# EAGLE design Pendulum Lamp PCB (EAGLE 9.1.0)
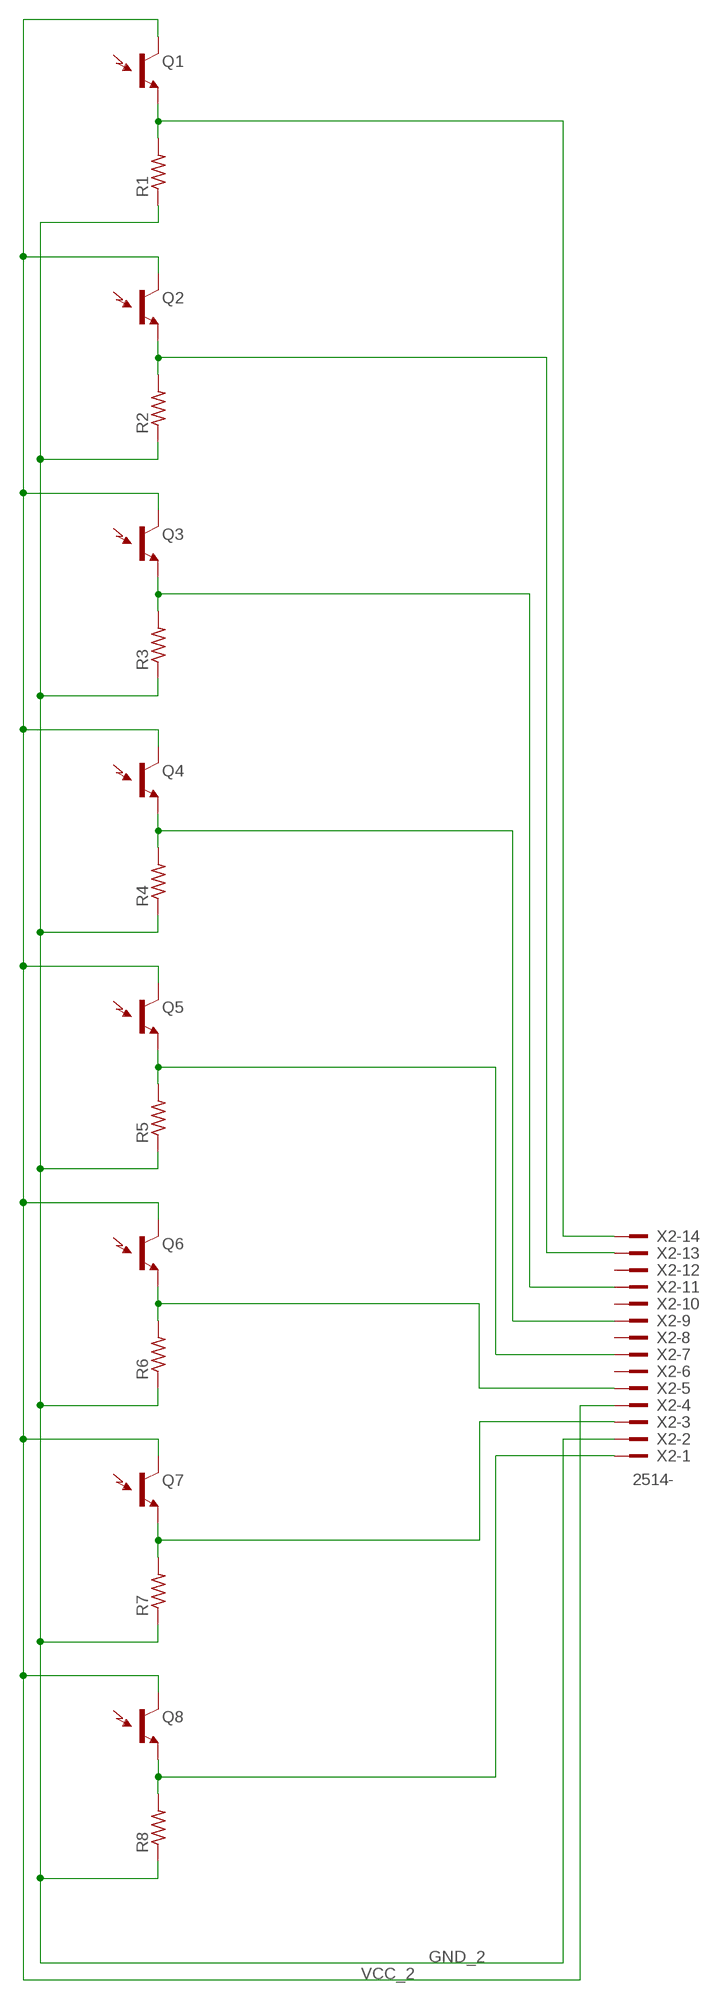
[diagram p0: schematic, sheet 1]

## Parts
Q1  LTR-301  [LTR-301]
Q2  LTR-301  [LTR-301]
Q3  LTR-301  [LTR-301]
Q4  LTR-301  [LTR-301]
Q5  LTR-301  [LTR-301]
Q6  LTR-301  [LTR-301]
Q7  LTR-301  [LTR-301]
Q8  LTR-301  [LTR-301]
R1  R-US_0204/7  [0204/7]
R2  R-US_0204/7  [0204/7]
R3  R-US_0204/7  [0204/7]
R4  R-US_0204/7  [0204/7]
R5  R-US_0204/7  [0204/7]
R6  R-US_0204/7  [0204/7]
R7  R-US_0204/7  [0204/7]
R8  R-US_0204/7  [0204/7]
X2  2514-  [PAK100/2500-14]

## Nets
GND_2: R1.1 R2.1 R3.1 R4.1 R5.1 R6.1 R7.1 R8.1 X2.2
N$31: Q1.E(E1) R1.2 X2.14
N$36: Q2.E(E1) R2.2 X2.13
N$40: Q3.E(E1) R3.2 X2.11
N$44: Q4.E(E1) R4.2 X2.9
N$48: Q5.E(E1) R5.2 X2.7
N$52: Q6.E(E1) R6.2 X2.5
N$56: Q7.E(E1) R7.2 X2.3
N$60: Q8.E(E1) R8.2 X2.1
VCC_2: Q1.C(C1) Q2.C(C1) Q3.C(C1) Q4.C(C1) Q5.C(C1) Q6.C(C1) Q7.C(C1) Q8.C(C1) X2.4
Unconnected: X2.6 X2.8 X2.10 X2.12

## Library data of the parts
Q1-Q8 = SparkFun-Sensors:LTR-301: LiteOn LTR-301 IR Phototransistor (Side-Receiving) Side-looking Infrared detectors. These simple devices operate at 940nm and work well for generic IR systems including remote control and touch-less object sensing. Using a simple ADC on any microcontroller will allow variable readings to be collected from the detector. Datasheet <http://www.sparkfun.com/datasheets/Components/LTR-301.pdf> SparkFun Products Infrared Emitters and Detectors <https://www.sparkfun.com/products/241> (SEN-00241); PROD_ID: DIO-10904; SF_ID: SEN-00241
R1-R8 = rcl:R-US_: RESISTOR, American symbol; SPICEPREFIX: R
X2 = con-3m:2514-: 3M (TM) Pak 100 4-Wall Header Source: 3M; OC_FARNELL: unknown; OC_NEWARK: unknown

## Board
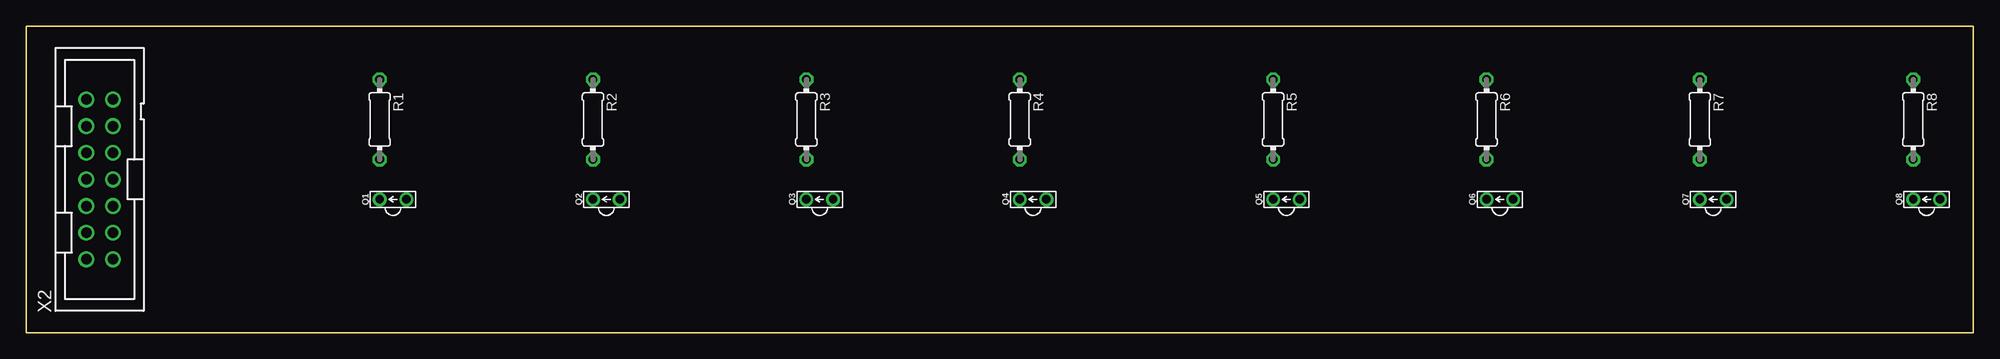
[diagram p1: board, top side]
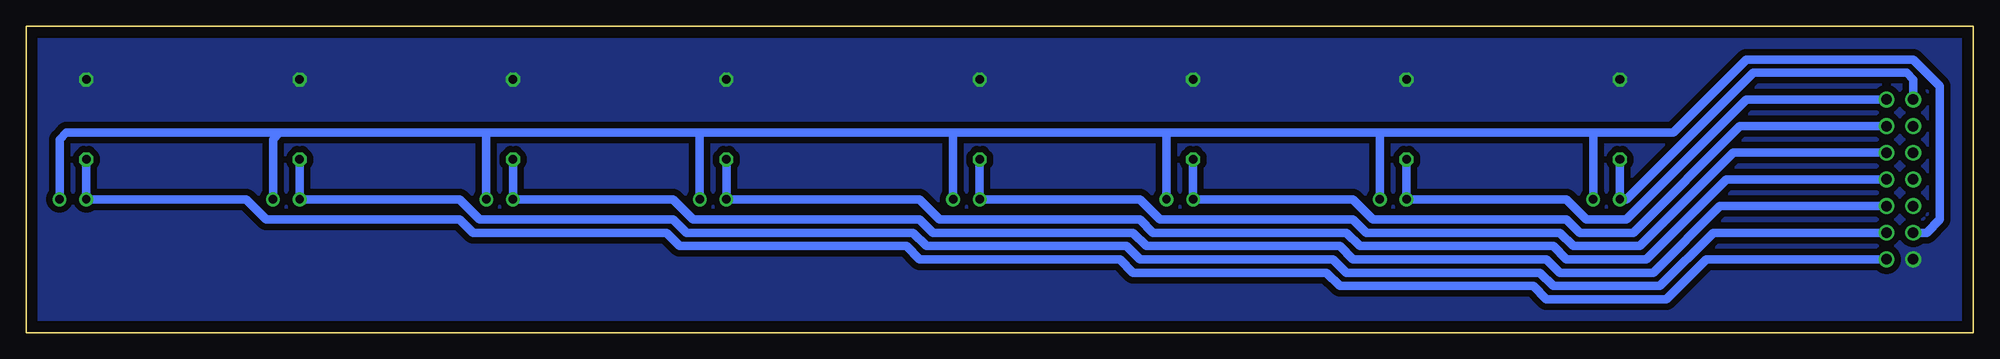
[diagram p2: board, bottom side, seen from below]

Size 185.42 x 29.21 mm. Coordinates in mm from the lower left corner, seen from the top.
Outline: 0,0 185.42,0 185.42,29.21 0,29.21 0,0
Copper layers (1*16): Top 0.035mm / dielectric 1.5mm / Bottom 0.035mm
Design rules "default *": minimum track width 6mil, minimum drill 0.35mm, track to track 15mil, track to pad 15mil, pad to pad 15mil, via to via 15mil, smd to smd 15mil, copper to edge 40mil, drill to drill 6mil, minimum pad ring 10mil, minimum via ring 8mil, stop-mask expansion 4mil, vias tented up to drill 0mil, thermal gap 10mil

### Footprints (pad centres in the part's own frame; a part is rotated, then mirrored left to right if it is on the bottom)
LTR-301 = drill 0.8: C 1.27,0; E -1.27,0
0204/7 = drill 0.813 octagon: 1 -3.81,0; 2 3.81,0
PAK100/2500-14 = drill 1 pad 1.422: 1 -7.62,-1.27; 2 -7.62,1.27; 3 -5.08,-1.27; 4 -5.08,1.27; 5 -2.54,-1.27; 6 -2.54,1.27; 7 0,-1.27; 8 0,1.27; 9 2.54,-1.27; 10 2.54,1.27; 11 5.08,-1.27; 12 5.08,1.27; 13 7.62,-1.27; 14 7.62,1.27

### Placement (x,y rotation side)
Q1  34.92,12.7 0 top
Q2  55.24,12.7 0 top
Q3  75.56,12.7 0 top
Q4  95.88,12.7 0 top
Q5  120.02,12.7 0 top
Q6  140.34,12.7 0 top
Q7  160.66,12.7 0 top
Q8  180.97,12.7 0 top
R1  33.66,20.32 270 top
R2  53.97,20.32 270 top
R3  74.3,20.32 270 top
R4  94.61,20.32 270 top
R5  118.75,20.32 270 top
R6  139.06,20.32 270 top
R7  159.38,20.32 270 top
R8  179.7,20.32 270 top
X2  6.98,14.6 90 top

### Tracks (layer width: path | path; a pad name or v marks a point on that pad's centre or on a via)
GND_2
  pour Bottom (isolate 0.61, no thermals): -0.63,29.84 -0.63,-0.63 185.42,-0.63 186.06,0 186.06,29.84
N$31
  Bottom 0.813: R1.2 Q1.E 33.02,12.7 20.95,24.77 6.35,24.77 5.71,24.13 X2.14
N$36
  Bottom 0.813: X2.13 21.59,22.23 33.02,10.79 36.83,10.79 38.73,12.7 Q2.E R2.2
N$40
  Bottom 0.813: R3.2 Q3.E 59.05,12.7 57.15,10.79 38.73,10.79 37.46,9.53 32.38,9.53 22.23,19.69 X2.11
N$44
  Bottom 0.813: R4.2 Q4.E 79.38,12.7 77.47,10.79 59.05,10.79 57.78,9.53 39.37,9.53 38.1,8.26 31.75,8.26 22.86,17.15 X2.9
N$48
  Bottom 0.813: R5.2 Q5.E 100.33,12.7 98.42,10.79 79.38,10.79 78.11,9.53 59.69,9.53 58.42,8.26 40.01,8.26 38.73,6.98 31.12,6.98 23.49,14.6 X2.7
N$52
  Bottom 0.813: R6.2 Q6.E 123.83,12.7 121.92,10.79 100.33,10.79 99.06,9.53 80.01,9.53 78.74,8.26 60.32,8.26 59.05,6.98 40.64,6.98 39.37,5.71 30.48,5.71 24.13,12.06 X2.5
N$56
  Bottom 0.813: R7.2 Q7.E 144.15,12.7 142.24,10.79 123.83,10.79 122.55,9.53 100.97,9.53 99.69,8.26 80.64,8.26 79.38,6.98 60.96,6.98 59.69,5.71 41.27,5.71 40.01,4.45 29.84,4.45 24.77,9.53 X2.3
N$60
  Bottom 0.813: R8.2 Q8.E 164.47,12.7 162.56,10.79 144.15,10.79 142.88,9.53 124.46,9.53 123.19,8.26 101.6,8.26 100.33,6.98 81.28,6.98 80.01,5.71 61.59,5.71 60.32,4.45 41.91,4.45 40.64,3.18 29.21,3.18 25.4,6.98 X2.1
VCC_2
  Bottom 0.813: Q1.C 36.2,19.05 | 36.2,19.05 36.83,19.05 56.52,19.05 | 56.52,19.05 76.83,19.05 | 76.83,19.05 97.16,19.05 | 97.16,19.05 121.28,19.05 | 121.28,19.05 141.6,19.05 | 141.6,19.05 161.29,19.05 | 161.29,19.05 181.61,19.05 182.25,18.41 Q8.C | Q7.C 161.93,18.41 161.29,19.05 | Q6.C 141.6,19.05 | Q5.C 121.28,19.05 | Q4.C 97.16,19.05 | Q3.C 76.83,19.05 | Q2.C 56.52,19.05 | 36.2,19.05 28.58,19.05 21.59,26.03 5.71,26.03 3.17,23.49 3.17,10.79 4.44,9.53 X2.4